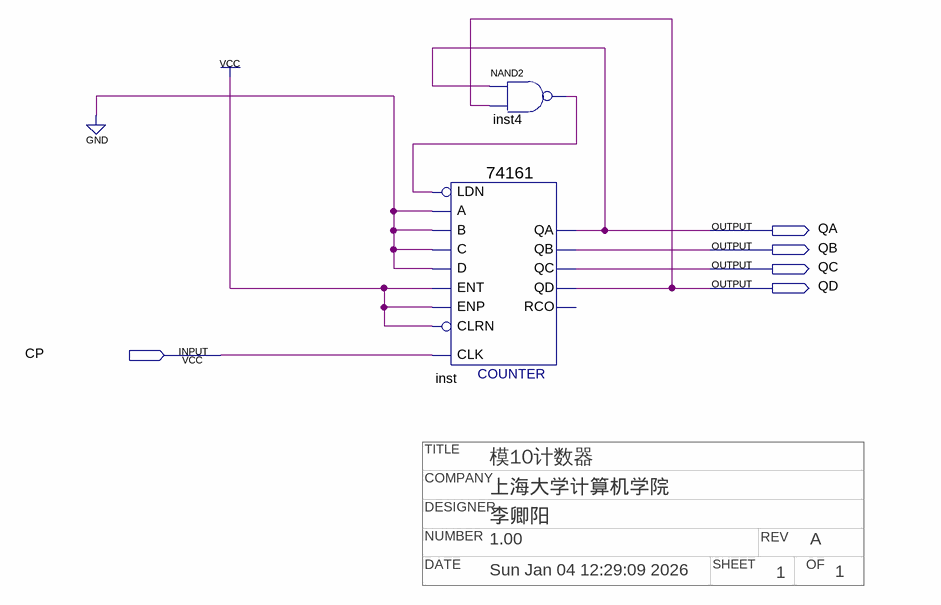
[diagram p0: schematic sheet]
// Quartus schematic w71.bdf as structural Verilog: 2 symbols, 5 pins
// Title block: TITLE: 模10计数器; COMPANY: 上海大学计算机学院; DESIGNER: 李卿阳; NUMBER: 1.00; REV: A; DATE: Sun Jan 04 12:29:09 2026; SHEET: 1; OF: 1
module w71 (
  input  CP,
  output QA,
  output QB,
  output QC,
  output QD
);

  wire inst4_out;

  \74161  inst (
    .CLRN(1'b1), .CLK(CP), .ENP(1'b1), .LDN(inst4_out), .A(1'b0), .D(1'b0), .ENT(1'b1), .B(1'b0), .C(1'b0),
    .QD(QD), .QC(QC), .QB(QB), .QA(QA));  // open: RCO
  nand inst4 (inst4_out, QA, QD);
endmodule
